# EAGLE design Project 2 (EAGLE 9.6.2)
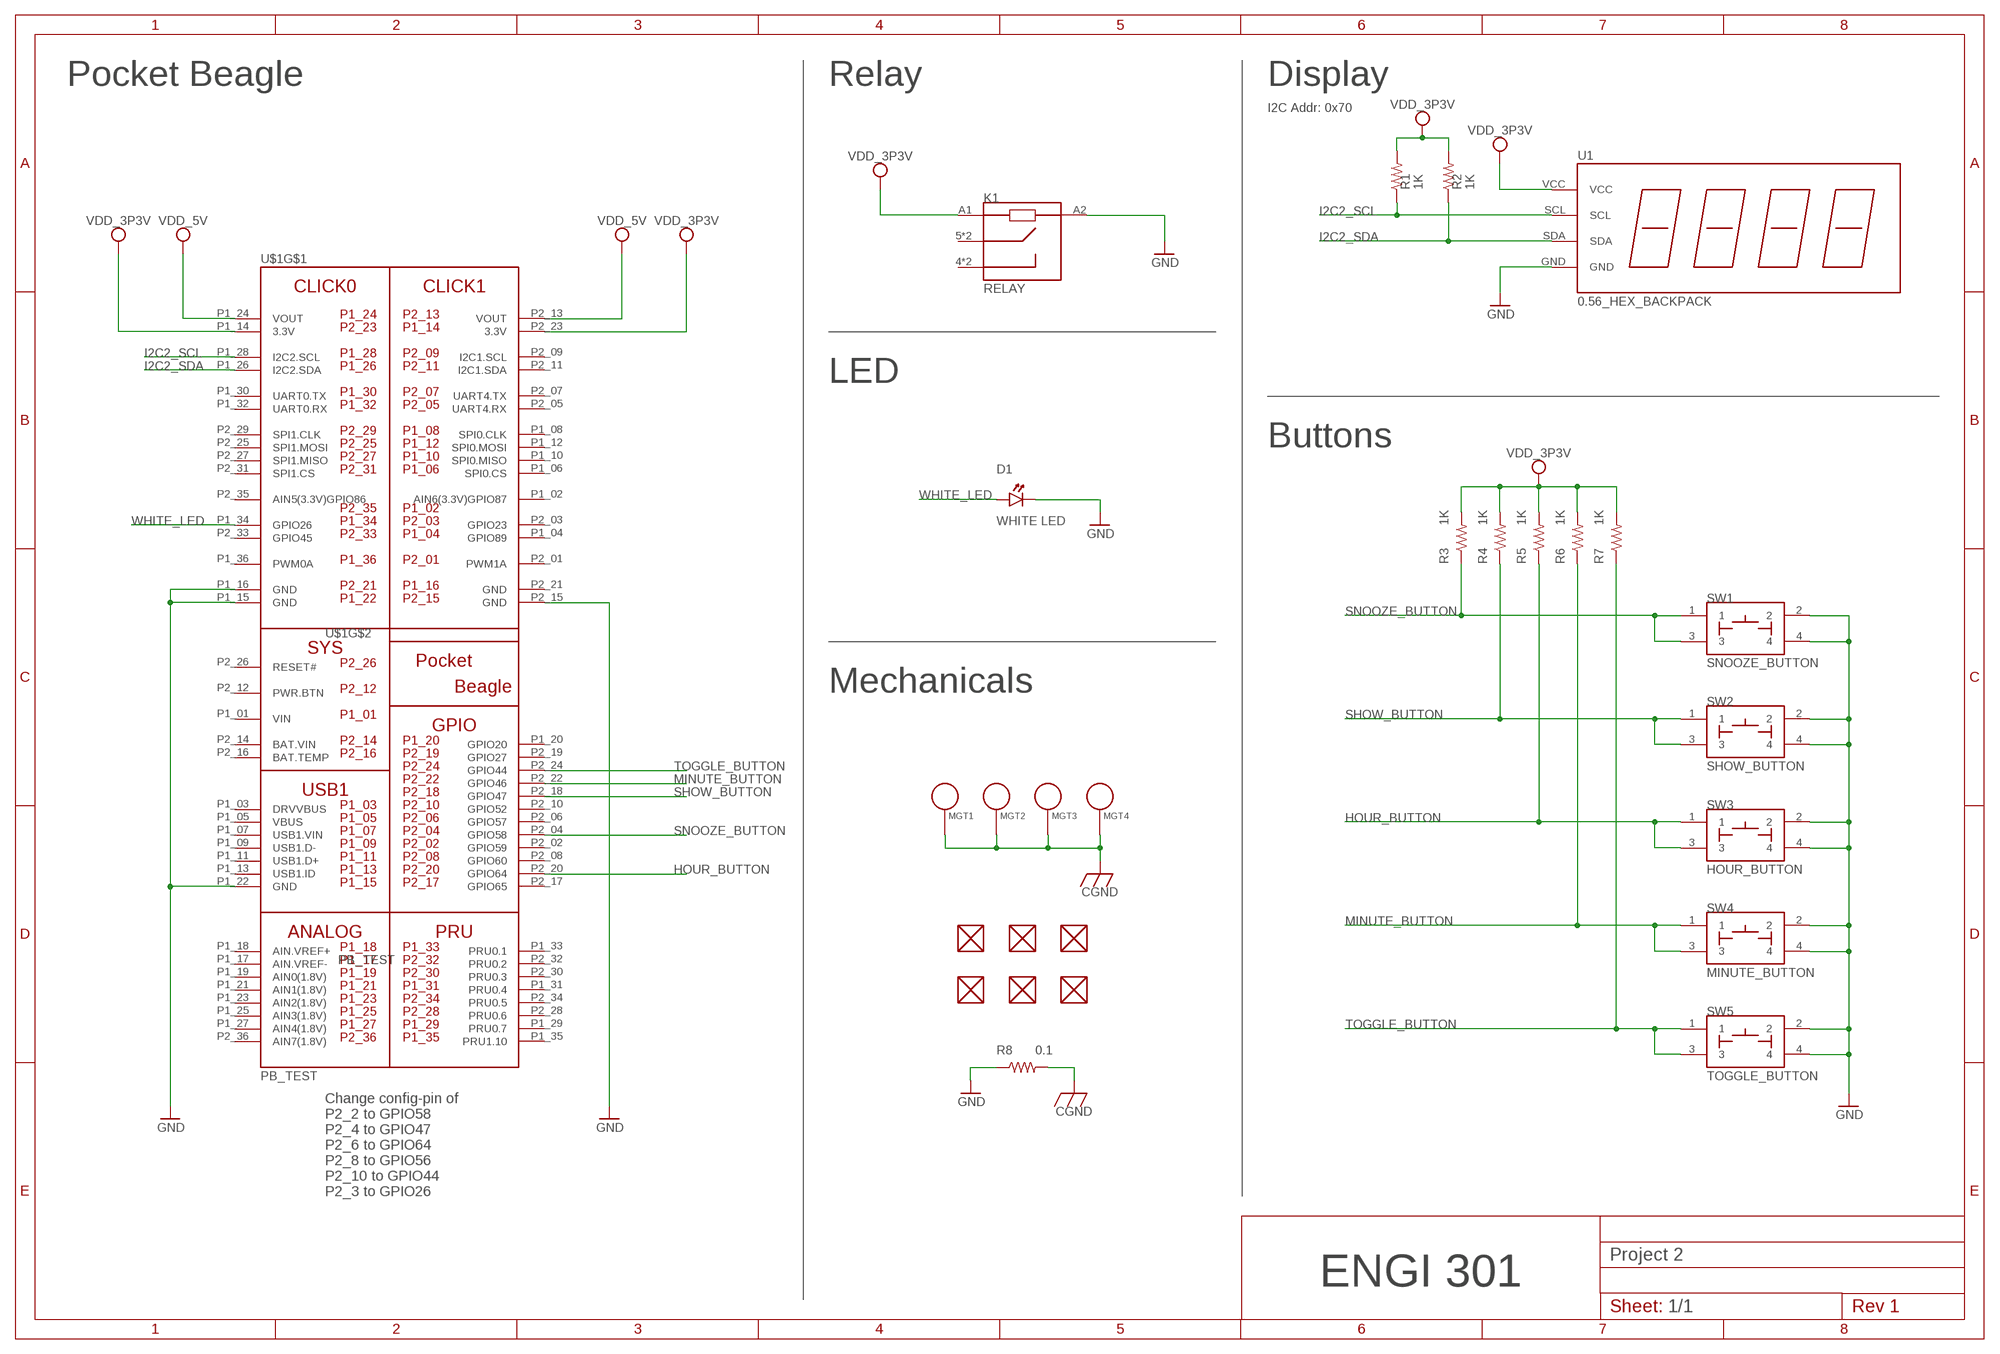
[diagram p0: schematic, sheet 1]

## Parts
D1  WHITE LED  LED  [EIA-STD]
FUD1  FIDUCIAL  [FIDUCIAL_40MIL]
FUD2  FIDUCIAL  [FIDUCIAL_40MIL]
FUD3  FIDUCIAL  [FIDUCIAL_40MIL]
FUD4  FIDUCIAL  [FIDUCIAL_40MIL]
FUD5  FIDUCIAL  [FIDUCIAL_40MIL]
FUD6  FIDUCIAL  [FIDUCIAL_40MIL]
K1  RELAY  RELAY_1-1415898-4  [RELAY_1-1415898-4]
MGT1  MOUNTING_HOLE  [MOUNTING_HOLE]
MGT2  MOUNTING_HOLE  [MOUNTING_HOLE]
MGT3  MOUNTING_HOLE  [MOUNTING_HOLE]
MGT4  MOUNTING_HOLE  [MOUNTING_HOLE]
R1  1K  R_R0603  [R0603]
R2  1K  R_R0603  [R0603]
R3  1K  R_R0603  [R0603]
R4  1K  R_R0603  [R0603]
R5  1K  R_R0603  [R0603]
R6  1K  R_R0603  [R0603]
R7  1K  R_R0603  [R0603]
R8  0.1  R_R0805  [R0805]
SW1  SNOOZE_BUTTON  PUSH_BUTTON  [BUTTON_12.5MM]
SW2  SHOW_BUTTON  PUSH_BUTTON  [BUTTON_12.5MM]
SW3  HOUR_BUTTON  PUSH_BUTTON  [BUTTON_12.5MM]
SW4  MINUTE_BUTTON  PUSH_BUTTON  [BUTTON_12.5MM]
SW5  TOGGLE_BUTTON  PUSH_BUTTON  [BUTTON_12.5MM]
U1  0.56_HEX_BACKPACK  [0.56_HEX_BACKPACK]
U$1  PB_TEST  [POCKETBEAGLE]

## Nets
CGND: MGT1.P$1 MGT2.P$1 MGT3.P$1 MGT4.P$1 R8.2
GND: D1.CATHODE K1.A2 R8.1 SW1.2 SW1.4 SW2.2 SW2.4 SW3.2 SW3.4 SW4.2 SW4.4 SW5.2 SW5.4 U1.GND U$1.P1_15(GND) U$1.P1_16(GND) U$1.P1_22(GND) U$1.P2_15(GND)
HOUR_BUTTON: R5.1 SW3.1 SW3.3 U$1.P2_20(GPIO64)
I2C2_SCL: R1.1 U1.SCL U$1.P1_28(I2C2.SCL)
I2C2_SDA: R2.1 U1.SDA U$1.P1_26(I2C2.SDA)
MINUTE_BUTTON: R6.1 SW4.1 SW4.3 U$1.P2_22(GPIO46)
SHOW_BUTTON: R4.1 SW2.1 SW2.3 U$1.P2_18(GPIO47)
SNOOZE_BUTTON: R3.1 SW1.1 SW1.3 U$1.P2_04(GPIO58)
TOGGLE_BUTTON: R7.1 SW5.1 SW5.3 U$1.P2_24(GPIO44)
VDD_3P3V: K1.A1 R1.2 R2.2 R3.2 R4.2 R5.2 R6.2 R7.2 U1.VCC U$1.P1_14(3.3V) U$1.P2_23(3.3V)
VDD_5V: U$1.P1_24(VOUT) U$1.P2_13(VOUT)
WHITE_LED: D1.ANODE U$1.P1_34(GPIO26)
Unconnected: FUD1.P$1 FUD2.P$1 FUD3.P$1 FUD4.P$1 FUD5.P$1 FUD6.P$1 K1.4 K1.5 K1.11 K1.14 U$1.P1_02(AIN6(3.3V)GPIO87) U$1.P1_03(DRVVBUS) U$1.P1_04(GPIO89) U$1.P1_05(VBUS) U$1.P1_06(SPI0.CS) U$1.P1_07(USB1.VIN) U$1.P1_08(SPI0.CLK) U$1.P1_09(USB1.D-) U$1.P1_10(SPI0.MISO) U$1.P1_11(USB1.D+) U$1.P1_12(SPI0.MOSI) U$1.P1_13(USB1.ID) U$1.P1_17(AIN.VREF-) U$1.P1_18(AIN.VREF+) U$1.P1_19(AIN0(1.8V)) U$1.P1_20(GPIO20) U$1.P1_21(AIN1(1.8V)) U$1.P1_23(AIN2(1.8V)) U$1.P1_25(AIN3(1.8V)) U$1.P1_27(AIN4(1.8V)) U$1.P1_29(PRU0.7) U$1.P1_30(UART0.TX) U$1.P1_31(PRU0.4) U$1.P1_32(UART0.RX) U$1.P1_33(PRU0.1) U$1.P1_35(PRU1.10) U$1.P1_36(PWM0A) U$1.P2_01(PWM1A) U$1.P2_02(GPIO59) U$1.P2_03(GPIO23) U$1.P2_05(UART4.RX) U$1.P2_06(GPIO57) U$1.P2_07(UART4.TX) U$1.P2_08(GPIO60) U$1.P2_09(I2C1.SCL) U$1.P2_10(GPIO52) U$1.P2_11(I2C1.SDA) U$1.P2_12(PWR.BTN) U$1.P2_16(BAT.TEMP) U$1.P2_17(GPIO65) U$1.P2_19(GPIO27) U$1.P2_25(SPI1.MOSI) U$1.P2_26(RESET#) U$1.P2_27(SPI1.MISO) U$1.P2_28(PRU0.6) U$1.P2_29(SPI1.CLK) U$1.P2_30(PRU0.3) U$1.P2_31(SPI1.CS) U$1.P2_32(PRU0.2) U$1.P2_33(GPIO45) U$1.P2_34(PRU0.5) U$1.P2_35(AIN5(3.3V)GPIO86) U$1.P2_36(AIN7(1.8V))

## Notes on the sheet
- Pocket Beagle | Relay | Display
- I2C Addr: 0x70
- LED
- Buttons
- Mechanicals
- Change config-pin of
  P2_2 to GPIO58
  P2_4 to GPIO47
  P2_6 to GPIO64
  P2_8 to GPIO56
  P2_10 to GPIO44
  P2_3 to GPIO26
- ENGI 301
- 1/1

## Power pins joined to a net without a drawn wire
BAT.VIN: U$1.P2_14(BAT.VIN)
GND: U$1.P2_21(GND)
VIN: U$1.P1_01(VIN)

## Library data of the parts
D1 = Project:LED: EIA-STD LED, LTST-C191TBKT
FUD1-FUD6 = Project:FIDUCIAL
K1 = Project:RELAY_1-1415898-4: RELAY GEN PURPOSE SPST 16A 24V Check prices <https://pricing.snapeda.com/parts/1-1415898-4/TE%20Connectivity/view-part?ref=eda>; AVAILABILITY: In Stock; COMMENT: 1-1415898-4; DESCRIPTION: Electromechanical Relay SPST-NO 16A 24VDC 1.44KOhm Through Hole; EU_ROHS_COMPLIANCE: Compliant; MF: TE Connectivity; MP: 1-1415898-4; PACKAGE: None; PRICE: None; PURCHASE-URL: https://pricing.snapeda.com/search/part/1-1415898-4/?ref=eda
MGT1-MGT4 = Project:MOUNTING_HOLE: Chassis Mounting Hole w/GND connection ability
R1-R8 = Project:R_: RESISTOR, American symbol
SW1-SW5 = Project:PUSH_BUTTON
U1 = Project:0.56_HEX_BACKPACK: 0.56" LED HEX Backback - Adafruit HT16K33 - https://www.adafruit.com/product/878 - https://www.adafruit.com/product/879 - https://www.adafruit.com/product/880 - https://www.adafruit.com/product/881 - https://www.adafruit.com/product/1002
U$1 = Project:PB_TEST

## Board
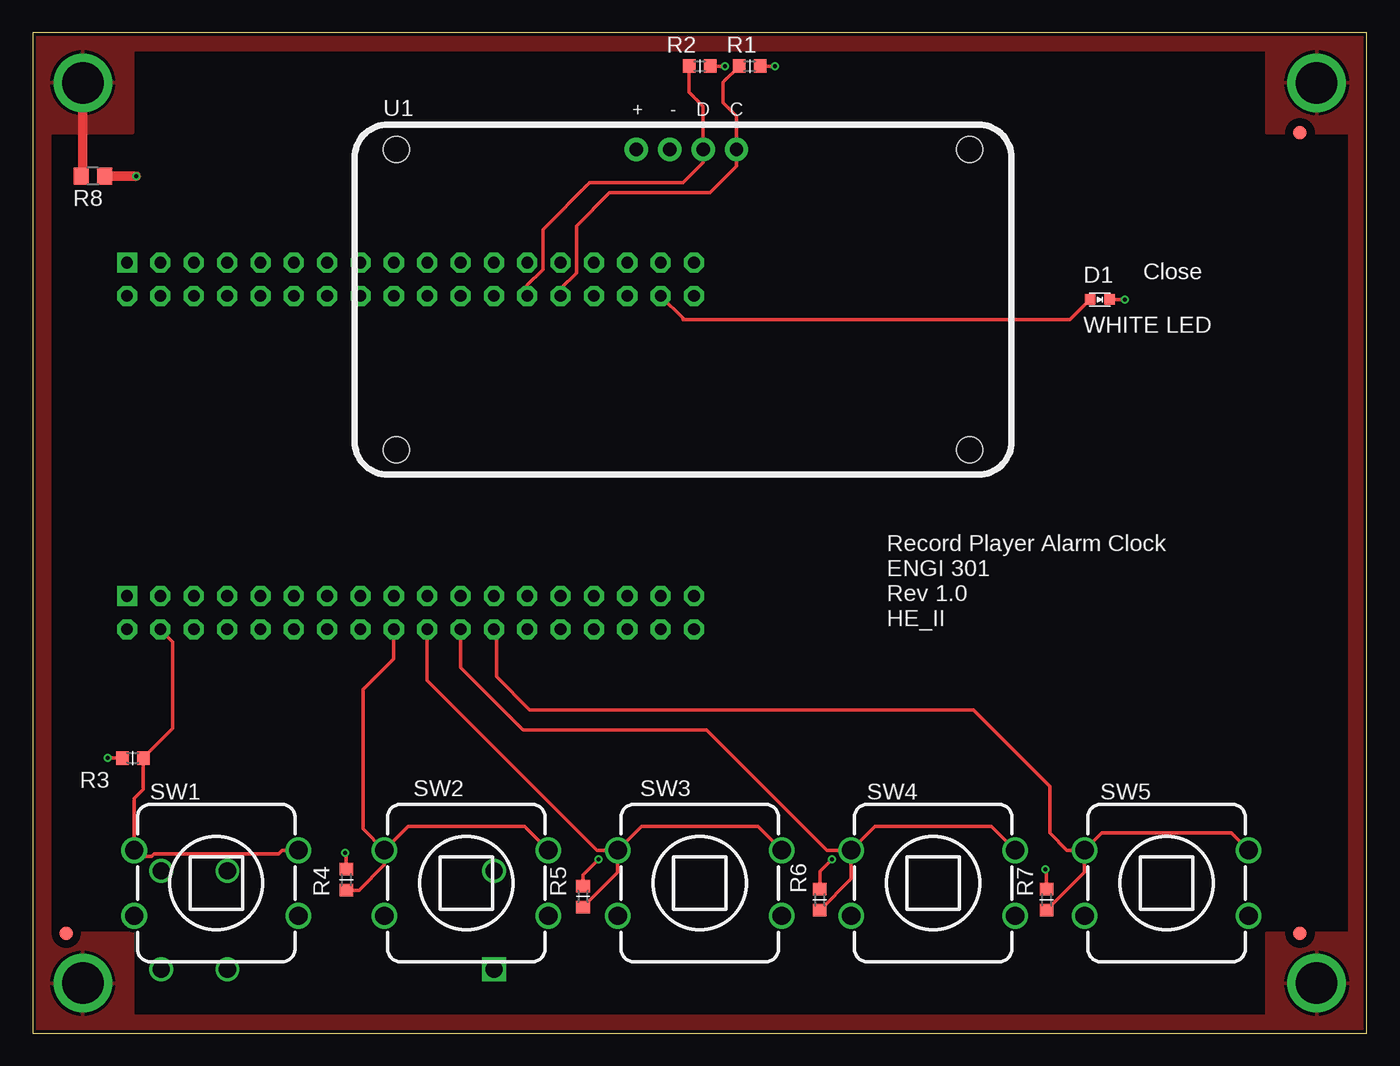
[diagram p1: board, top side]
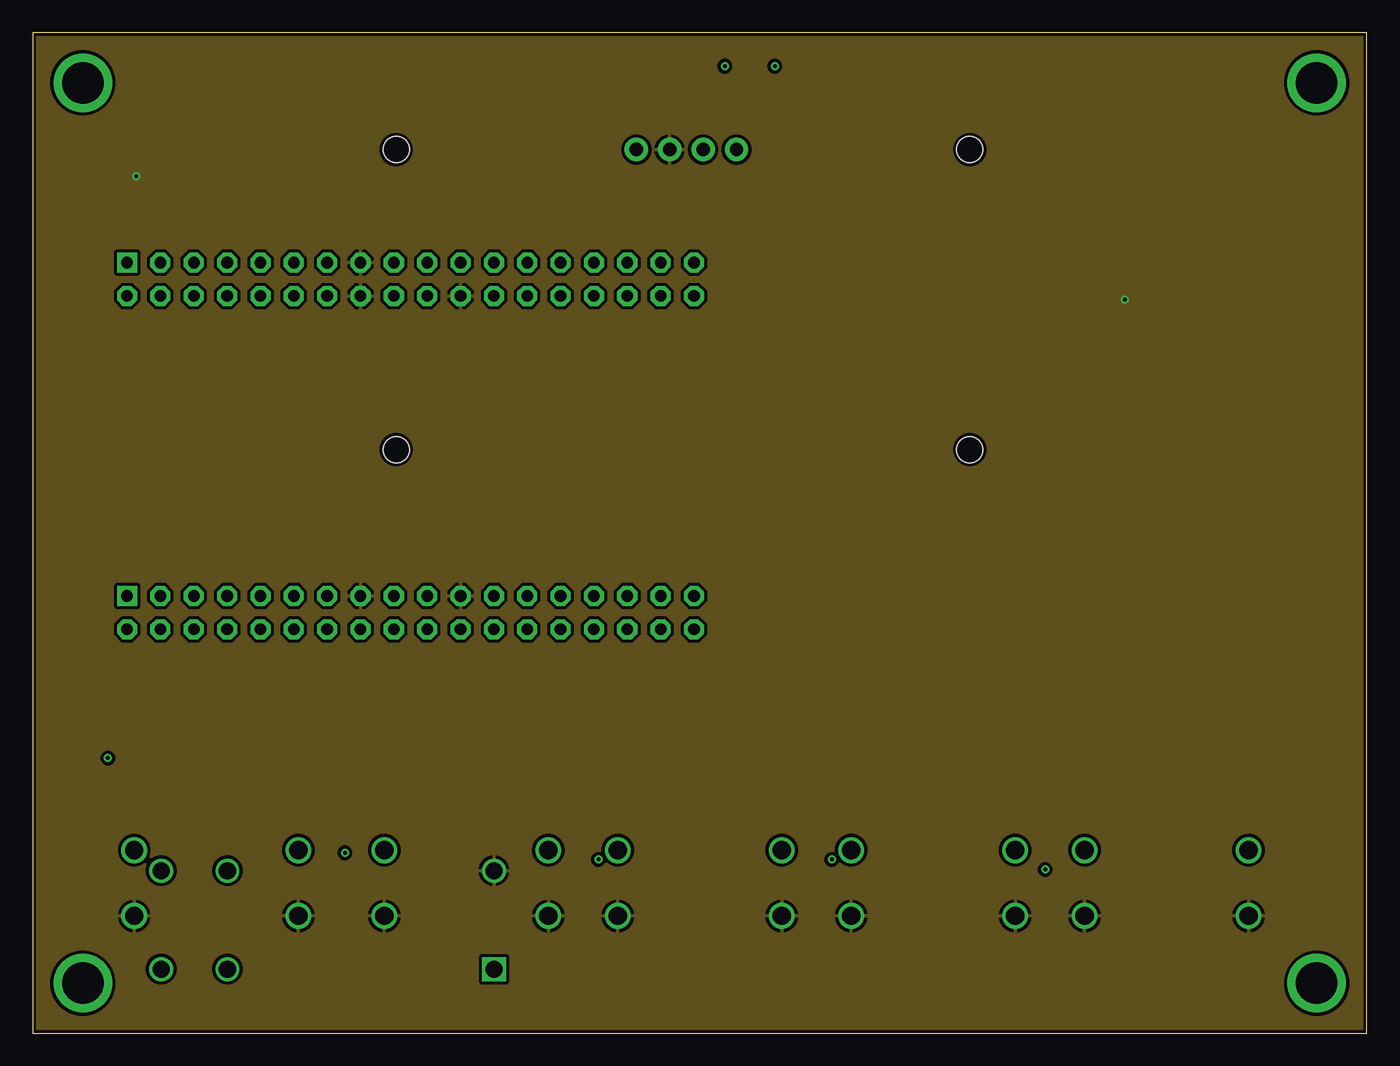
[diagram p2: board, inner layer Route2]
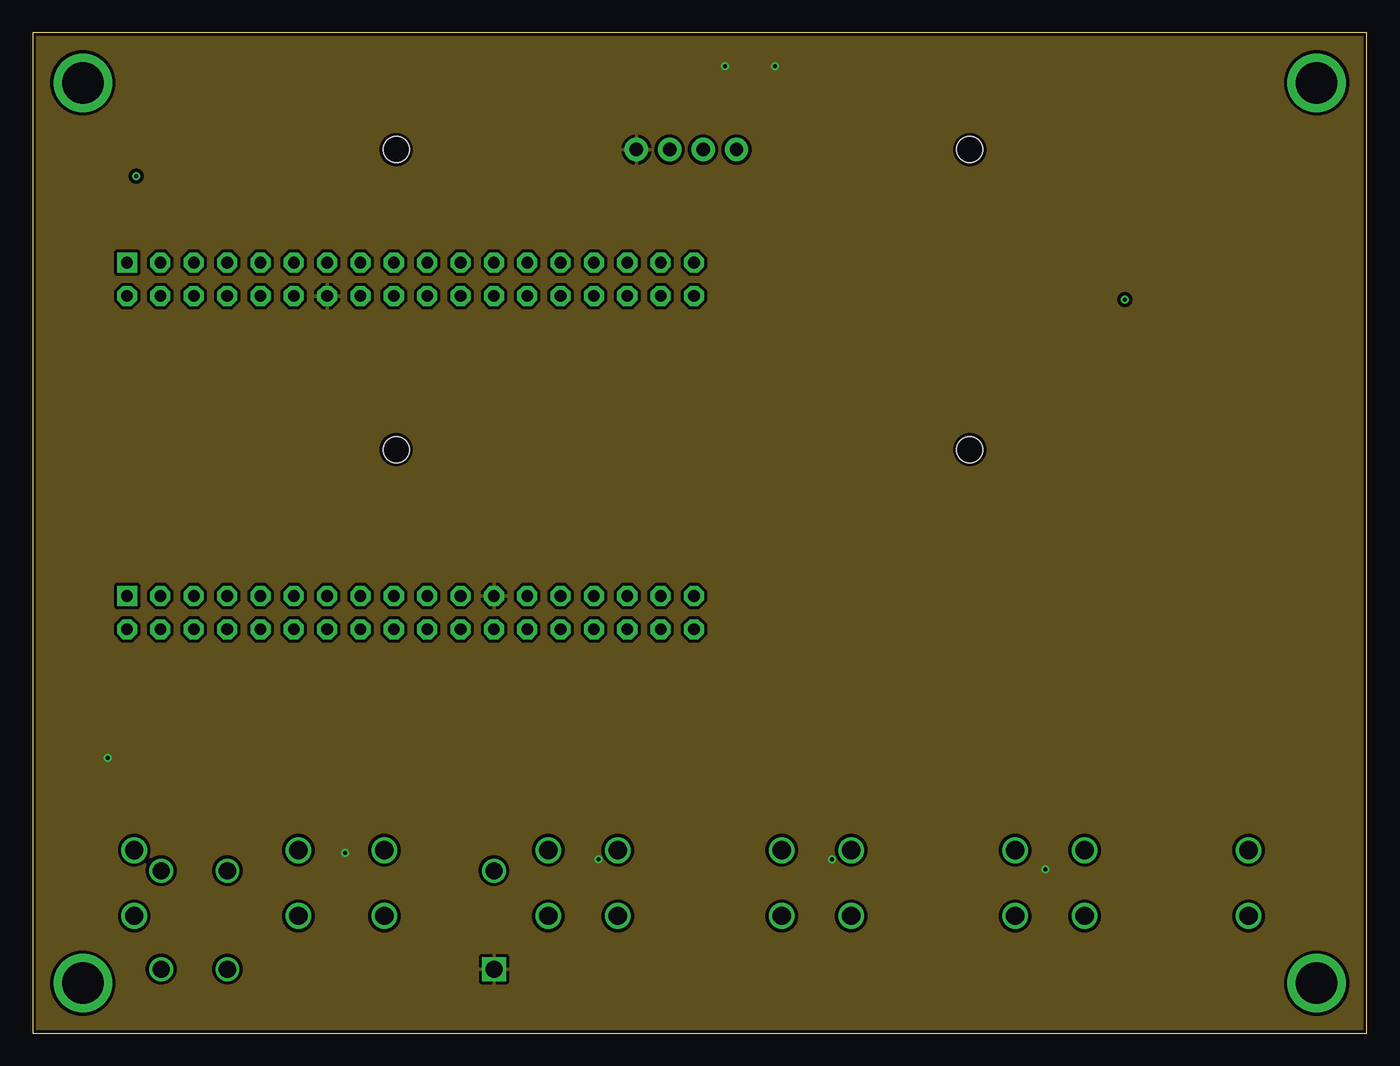
[diagram p3: board, inner layer Route15]
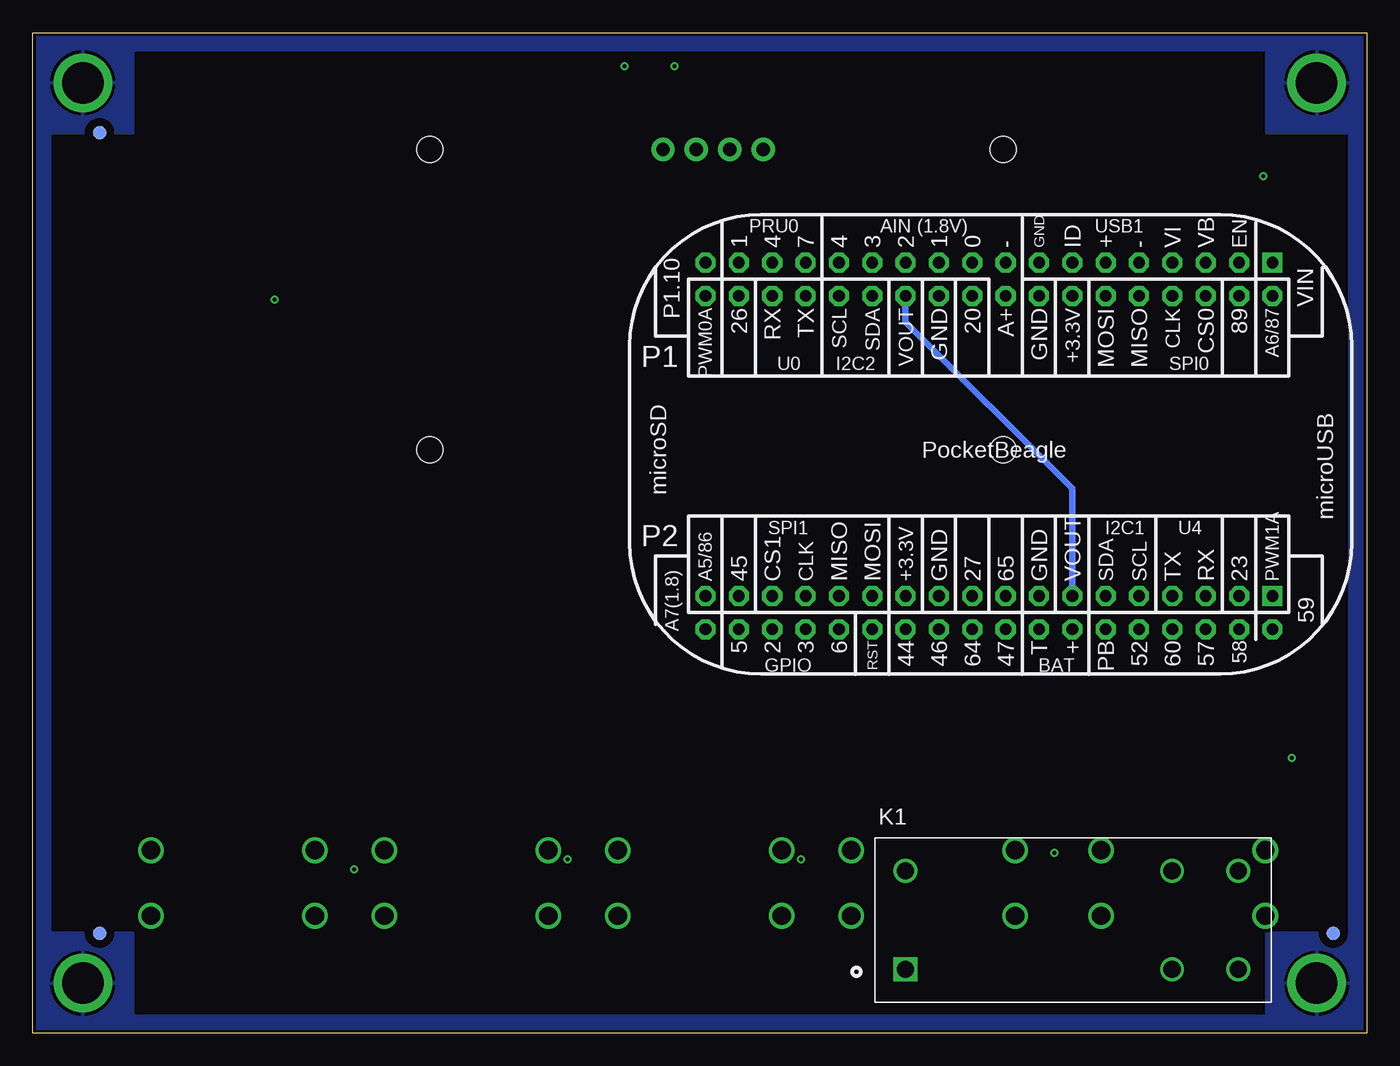
[diagram p4: board, bottom side, seen from below]

Size 101.6 x 76.2 mm. Coordinates in mm from the lower left corner, seen from the top.
Outline: 0,0 101.6,0 101.6,76.2 0,76.2 0,0
Copper layers (1*2*15*16): Top 0.035mm / dielectric 0.23mm / Route2 0.035mm / dielectric 0.93mm / Route15 0.035mm / dielectric 0.23mm / Bottom 0.035mm
Design rules "ENGI301_4lyr": minimum track width 10mil, minimum drill 12mil, track to track 10mil, track to pad 10mil, pad to pad 10mil, via to via 10mil, smd to smd 10mil, copper to edge 10mil, drill to drill 12mil, minimum pad ring 6mil, minimum via ring 6mil, stop-mask expansion 3mil, vias tented up to drill 25mil, thermal gap 10mil

### Footprints (pad centres in the part's own frame; a part is rotated, then mirrored left to right if it is on the bottom)
EIA-STD = smd 0.8 x 0.8: ANODE -0.75,0; CATHODE 0.75,0
FIDUCIAL_40MIL = smd 1.016 x 1.016: P$1 0,0
RELAY_1-1415898-4 = drill 1.3: 4 13.08,3.48; 5 8.04,3.48; 11 8.04,-4.02; 14 13.08,-4.02; A2 -12.26,3.48 | drill 1.3 square: A1 -12.26,-4.02
MOUNTING_HOLE = drill 3.175 pad 4.445: P$1 0,0
R0603 = smd 0.95 x 1.031: 1 -0.8,0; 2 0.8,0
R0805 = smd 1.143 x 1.27: 1 -0.889,0; 2 0.889,0
BUTTON_12.5MM = drill 1.4: 1 -6.25,2.5; 2 -6.25,-2.5; 3 6.25,2.5; 4 6.25,-2.5
0.56_HEX_BACKPACK = drill 1.016 pad 1.778: GND -1.016,11.43; SCL 4.064,11.43; SDA 1.524,11.43; VCC -3.556,11.43 | hole 2: -21.844,-11.43; 21.844,-11.43; -21.844,11.43; 21.844,11.43
POCKETBEAGLE = drill 0.889 pad 1.524 square: P1_01 5.91,3.53; P2_01 5.91,28.93 | drill 0.889 pad 1.524 octagon: P1_02 5.91,6.07; P1_03 8.45,3.53; P1_04 8.45,6.07; P1_05 10.99,3.53; P1_06 10.99,6.07; P1_07 13.53,3.53; P1_08 13.53,6.07; P1_09 16.07,3.53; P1_10 16.07,6.07; P1_11 18.61,3.53; P1_12 18.61,6.07; P1_13 21.15,3.53; P1_14 21.15,6.07; P1_15 23.69,3.53; P1_16 23.69,6.07; P1_17 26.23,3.53; P1_18 26.23,6.07; P1_19 28.77,3.53; P1_20 28.77,6.07; P1_21 31.31,3.53; P1_22 31.31,6.07; P1_23 33.85,3.53; P1_24 33.85,6.07; P1_25 36.39,3.53; P1_26 36.39,6.07; P1_27 38.93,3.53; P1_28 38.93,6.07; P1_29 41.47,3.53; P1_30 41.47,6.07; P1_31 44.01,3.53; P1_32 44.01,6.07; P1_33 46.55,3.53; P1_34 46.55,6.07; P1_35 49.09,3.53; P1_36 49.09,6.07; P2_02 5.91,31.47; P2_03 8.45,28.93; P2_04 8.45,31.47; P2_05 10.99,28.93; P2_06 10.99,31.47; P2_07 13.53,28.93; P2_08 13.53,31.47; P2_09 16.07,28.93; P2_10 16.07,31.47; P2_11 18.61,28.93; P2_12 18.61,31.47; P2_13 21.15,28.93; P2_14 21.15,31.47; P2_15 23.69,28.93; P2_16 23.69,31.47; P2_17 26.23,28.93; P2_18 26.23,31.47; P2_19 28.77,28.93; P2_20 28.77,31.47; P2_21 31.31,28.93; P2_22 31.31,31.47; P2_23 33.85,28.93; P2_24 33.85,31.47; P2_25 36.39,28.93; P2_26 36.39,31.47; P2_27 38.93,28.93; P2_28 38.93,31.47; P2_29 41.47,28.93; P2_30 41.47,31.47; P2_31 44.01,28.93; P2_32 44.01,31.47; P2_33 46.55,28.93; P2_34 46.55,31.47; P2_35 49.09,28.93; P2_36 49.09,31.47

### Placement (x,y rotation side)
D1  81.28,55.88 0 top
FUD1  96.52,7.62 0 bottom
FUD2  96.52,68.58 0 bottom
FUD3  2.54,7.62 0 bottom
FUD4  96.52,68.58 0 top
FUD5  96.52,7.62 0 top
FUD6  2.54,7.62 0 top
K1  22.86,8.89 0 bottom
MGT1  97.79,3.81 0 top
MGT2  3.81,3.81 0 top
MGT3  97.79,72.39 0 top
MGT4  3.81,72.39 0 top
R1  54.61,73.66 0 top
R2  50.8,73.66 0 top
R3  7.62,20.95 180 top
R4  23.88,11.68 90 top
R5  41.91,10.41 90 top
R6  59.94,10.16 90 top
R7  77.22,10.16 90 top
R8  4.57,65.28 180 top
SW1  13.97,11.43 0 top
SW2  33.02,11.43 0 top
SW3  50.8,11.43 0 top
SW4  68.58,11.43 0 top
SW5  86.36,11.43 0 top
U1  49.53,55.88 0 top
U$1  1.27,62.23 180 bottom

### Tracks (layer width: path | path; a pad name or v marks a point on that pad's centre or on a via)
CGND
  Top 0.737: MGT4.P$1 3.81,65.41 R8.2
  pour Top: -1.27,38.1 -1.27,77.47 102.87,77.47 102.87,38.1 100.33,38.1 100.33,68.58 93.98,68.58 93.98,74.93 7.62,74.93 7.62,68.58 1.27,68.58 1.27,38.1
  pour Top: -1.27,38.1 -1.27,-1.27 102.87,-1.27 102.87,38.1 100.33,38.1 100.33,7.62 93.98,7.62 93.98,1.27 7.62,1.27 7.62,7.62 1.27,7.62 1.27,38.1
  pour Bottom: -1.27,38.1 -1.27,77.47 102.87,77.47 102.87,38.1 100.33,38.1 100.33,68.58 93.98,68.58 93.98,74.93 7.62,74.93 7.62,68.58 1.27,68.58 1.27,38.1
  pour Bottom: -1.27,38.1 -1.27,-1.27 102.87,-1.27 102.87,38.1 100.33,38.1 100.33,7.62 93.98,7.62 93.98,1.27 7.62,1.27 7.62,7.62 1.27,7.62 1.27,38.1
GND  (via drill 0.3 pad 0.61)
  Top 0.254: D1.CATHODE v83.19,55.88
  Top 0.737: R8.1 v7.87,65.28
  pour Route2: -2.54,78.74 104.14,78.74 104.14,-2.54 -2.54,-2.54
HOUR_BUTTON
  Top 0.254: R5.1 44.55,12.25 SW3.1 | SW3.1 46.37,15.75 55.23,15.75 SW3.3 | SW3.1 42.97,13.93 30.04,26.86 U$1.P2_20
I2C2_SCL
  Top 0.254: U$1.P1_28 40.2,56.71 41.4,57.91 41.4,61.47 43.94,64.01 51.56,64.01 53.59,66.04 U1.SCL 53.59,69.85 52.58,70.87 52.58,72.43 R1.1
I2C2_SDA
  Top 0.254: U$1.P1_26 37.66,56.96 38.86,58.17 38.86,61.21 42.42,64.77 49.53,64.77 51.05,66.29 U1.SDA 51.05,70.61 50,71.67 R2.1
MINUTE_BUTTON
  Top 0.254: R6.1 62.33,11.75 SW4.1 | SW4.1 64.15,15.75 73.01,15.75 SW4.3 | SW4.1 60.49,13.93 51.31,23.11 37.34,23.11 32.58,27.87 U$1.P2_22
SHOW_BUTTON
  Top 0.254: R4.1 24.85,10.88 26.77,12.8 SW2.1 | SW2.1 28.59,15.75 37.45,15.75 SW2.3 | SW2.1 25.15,15.55 25.15,26.16 27.5,28.52 U$1.P2_18
SNOOZE_BUTTON
  Top 0.254: SW1.3 19.01,13.93 18.74,13.66 9.24,13.66 9.05,13.46 8.19,13.46 SW1.1 7.72,17.88 8.42,18.58 R3.1 10.67,23.2 10.67,29.81 U$1.P2_04
TOGGLE_BUTTON
  Top 0.254: R7.1 80.11,12.25 SW5.1 | SW5.1 81.42,15.24 91.3,15.24 SW5.3 | U$1.P2_24 35.31,30.57 35.31,27.18 37.85,24.64 71.63,24.64 77.47,18.8 77.47,15.24 78.78,13.93 SW5.1
VDD_3P3V  (via drill 0.3 pad 0.61)
  Top 0.254: R2.2 v52.7,73.66 | R1.2 v56.52,73.66 | R3.2 v5.71,20.95 | v23.77,13.74 23.88,13.63 R4.2 | v43.07,13.23 41.91,12.06 R5.2 | v60.85,13.23 59.94,12.32 R6.2 | R7.2 77.22,12.57 v77.11,12.47
  pour Route15: -5.08,81.28 106.68,81.28 106.68,-5.08 -5.08,-5.08
VDD_5V
  Bottom 0.508: U$1.P2_13 22.42,41.47 35.12,54.17 U$1.P1_24
WHITE_LED
  Top 0.254: U$1.P1_34 49.53,54.45 49.53,54.36 79.01,54.36 D1.ANODE

### Text on the board
tPlace: Close | Record Player Alarm Clock / ENGI 301 / Rev 1.0 / HE_II